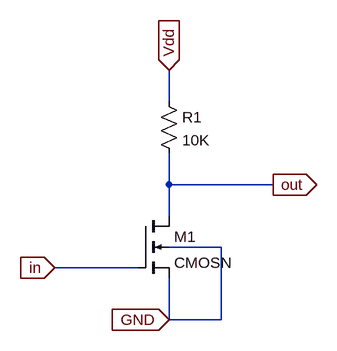
[diagram p0: schematic resistive_load_inverter.asc]
resistive_load_inverter.asc, the LTspice schematic file:
Version 4
SHEET 1 880 680
WIRE 256 32 256 -16
WIRE 256 160 256 112
WIRE 416 160 256 160
WIRE 256 208 256 160
WIRE 336 256 256 256
WIRE 208 288 80 288
WIRE 256 368 256 304
WIRE 336 368 336 256
WIRE 336 368 256 368
FLAG 416 160 out
IOPIN 416 160 Out
FLAG 256 -16 Vdd
IOPIN 256 -16 In
FLAG 80 288 in
IOPIN 80 288 In
FLAG 256 368 GND
IOPIN 256 368 In
SYMBOL cmosn 208 208 R0
SYMATTR InstName M1
SYMATTR Value2 l=180n w=1u
SYMBOL res 240 16 R0
SYMATTR InstName R1
SYMATTR Value 10K

The netlist it stands for:
* resistive_load_inverter.asc
M1 out in GND GND CMOSN l=180n w=1u
R1 Vdd out 10K
.model NMOS NMOS
.model PMOS PMOS
.lib standard.mos
.backanno
.end